# Altium schematic sheet AD9838模块.SchDoc
size A4
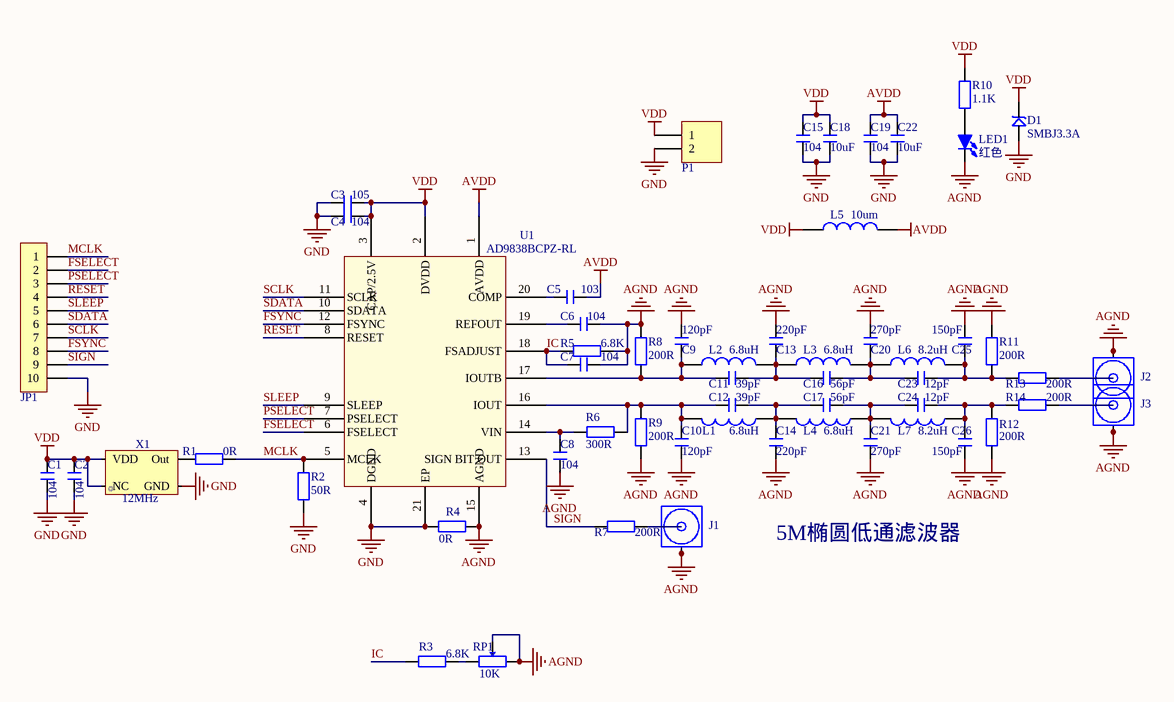
[diagram p0: AD9838模块.SchDoc]

## Parts
C1  104  [0603P]
C2  104  [0603P]
C3  105  [0603P]
C4  104  [0603P]
C5  103  [0603P]
C6  104  [0603P]
C7  104  [0603P]
C8  104  [0603P]
C9  120pF  [0603P]
C10  120pF  [0603P]
C11  39pF  [0603P]
C12  39pF  [0603P]
C13  220pF  [0603P]
C14  220pF  [0603P]
C15  104  [0603P]
C16  56pF  [0603P]
C17  56pF  [0603P]
C18  10uF  [0603P]
C19  104  [0603P]
C20  270pF  [0603P]
C21  270pF  [0603P]
C22  10uF  [0603P]
C23  12pF  [0603P]
C24  12pF  [0603P]
C25  150pF  [0603P]
C26  150pF  [0603P]
D1  SMBJ3.3A  [SMBJ]
J1  COAX  [MCX5.08-5-H]  (value not drawn)
J2  COAX  [MCX5.08-5-H]  (value not drawn)
J3  COAX  [MCX5.08-5-H]  (value not drawn)
JP1  HDR-1X10  [HDR-1X10_H]  (value not drawn)
L1  6.8uH  [0603P]
L2  6.8uH  [0603P]
L3  6.8uH  [0603P]
L4  6.8uH  [0603P]
L5  10um  [0603P]
L6  8.2uH  [0603P]
L7  8.2uH  [0603P]
LED1  红色  [LED 0805G]
P1  Header 2  [HDR2X1_B2]  (value not drawn)
R1  0R  [0603P]
R2  50R  [0603P]
R3  6.8K  [0603P]
R4  0R  [0603P]
R5  6.8K  [0603P]
R6  300R  [0603P]
R7  200R  [0603P]
R8  200R  [0603P]
R9  200R  [0603P]
R10  1.1K  [0603P]
R11  200R  [0603P]
R12  200R  [0603P]
R13  200R  [0603P]
R14  200R  [0603P]
RP1  10K  [3296W]
U1  AD9838BCPZ-RL  [CP_20_10]
X1  Frequency: 12MHz  [X-CPX75]  (hidden comment: XTAL)

## Nets
AGND: C6.1 C7.1 C8.1 C9.1 C10.1 C13.1 C14.1 C20.1 C21.1 C25.1 C26.1 J1.2(GND) J1.3(GND) J1.4(GND) J1.5(GND) J2.2(GND) J2.3(GND) J2.4(GND) J2.5(GND) J3.2(GND) J3.3(GND) J3.4(GND) J3.5(GND) LED1.2(K) R4.1 R5.1 R8.2 R9.1 R11.2 R12.2 RP1.2 RP1.3 U1.15(AGND)
AVDD: C5.1 C19.2 C22.2 L5.2 U1.1(AVDD)
GND: C1.2 C2.2 C3.2 C4.2 C15.1 C18.1 C19.1 C22.1 D1.1 JP1.10 P1.2 R2.2 R4.2 U1.4(DGND) U1.21(EP) X1.2(GND)
VDD: C1.1 C2.1 C3.1 C4.1 C15.2 C18.2 D1.2 L5.1 P1.1 R10.2 U1.2(DVDD) U1.3(CAP/2.5V) X1.1(NC) X1.4(VDD)
FSELECT: JP1.2 U1.6(FSELECT)
FSYNC: JP1.8 U1.12(FSYNC)
IC: C7.2 R3.2 R5.2 U1.18(FSADJUST)
MCLK: JP1.1 R1.1 R2.1 U1.5(MCLK)
PSELECT: JP1.3 U1.7(PSELECT)
RESET: JP1.4 U1.8(RESET)
SCLK: JP1.7 U1.11(SCLK)
SDATA: JP1.6 U1.10(SDATA)
SIGN: JP1.9 R7.2 U1.13(SIGN_BIT_OUT)
SLEEP: JP1.5 U1.9(SLEEP)
NetC5_2: C5.2 U1.20(COMP)
NetC6_2: C6.2 U1.19(REFOUT)
NetC8_2: C8.2 R6.2 U1.14(VIN)
NetC9_2: C9.2 C11.1 L2.1 R8.1 U1.17(IOUTB)
NetC10_2: C10.2 C12.2 L1.2 R6.1 R9.2 U1.16(IOUT)
NetC11_2: C11.2 C13.2 C16.1 L2.2 L3.1
NetC12_1: C12.1 C14.2 C17.2 L1.1 L4.2
NetC16_2: C16.2 C20.2 C23.1 L3.2 L6.1
NetC17_1: C17.1 C21.2 C24.2 L4.1 L7.2
NetC23_2: C23.2 C25.2 L6.2 R11.1 R13.2
NetC24_1: C24.1 C26.2 L7.1 R12.1 R14.2
NetJ1_1: J1.1(Signal) R7.1
NetJ2_1: J2.1(Signal) R13.1
NetJ3_1: J3.1(Signal) R14.1
NetLED1_1: LED1.1(A) R10.1
NetR1_2: R1.2 X1.3(Out)
NetR3_1: R3.1 RP1.1

## Notes on the sheet
- 5M椭圆低通滤波器
- Title
- Size:
- Date:
- A4
- Number:
- Time:
- Revision:
- Sheet
- of
- File:

## Library data of the parts
C1-C26 = C: 无极性贴片电容; 版权归属: 源创客; BOM名称: 无极性贴片电容; 学习资源: www.ooocke.com
D1 = SMBJ: TVS
JP1 = Header 10: 10P接插件; 版权归属: 源创客; BOM名称: 10P接插件; 学习资源: www.ooocke.com
L1-L7 = L: 小功率贴片电感; 版权归属: 源创客; BOM名称: 小功率贴片电感; 学习资源: www.ooocke.com
LED1 = LED-SMD: 贴片LED; 版权归属: 源创客; BOM名称: 贴片LED; 学习资源: www.ooocke.com
P1 = Header 2: 接插件; LatestRevisionDate: 17-Jul-2002; LatestRevisionNote: Re-released for DXP Platform.; Publisher: Altium Limited
R1-R14 = R: 贴片电阻; 版权归属: 源创客; BOM名称: 贴片电阻; 学习资源: www.ooocke.com
RP1 = RP-ID: 插件单联电位器; BOM名称: 插件电位器; 版权归属: 源创客; 学习资源: www.ooocke.com
U1 = AD9838BCPZ-RL: DSS直接数字频率合成器; Value: Value; Type: Type; RefDes: RefDes
X1 = XTAL_Oscillator: 有源晶振